# EAGLE schematic Plush6A (EAGLE 5.11)
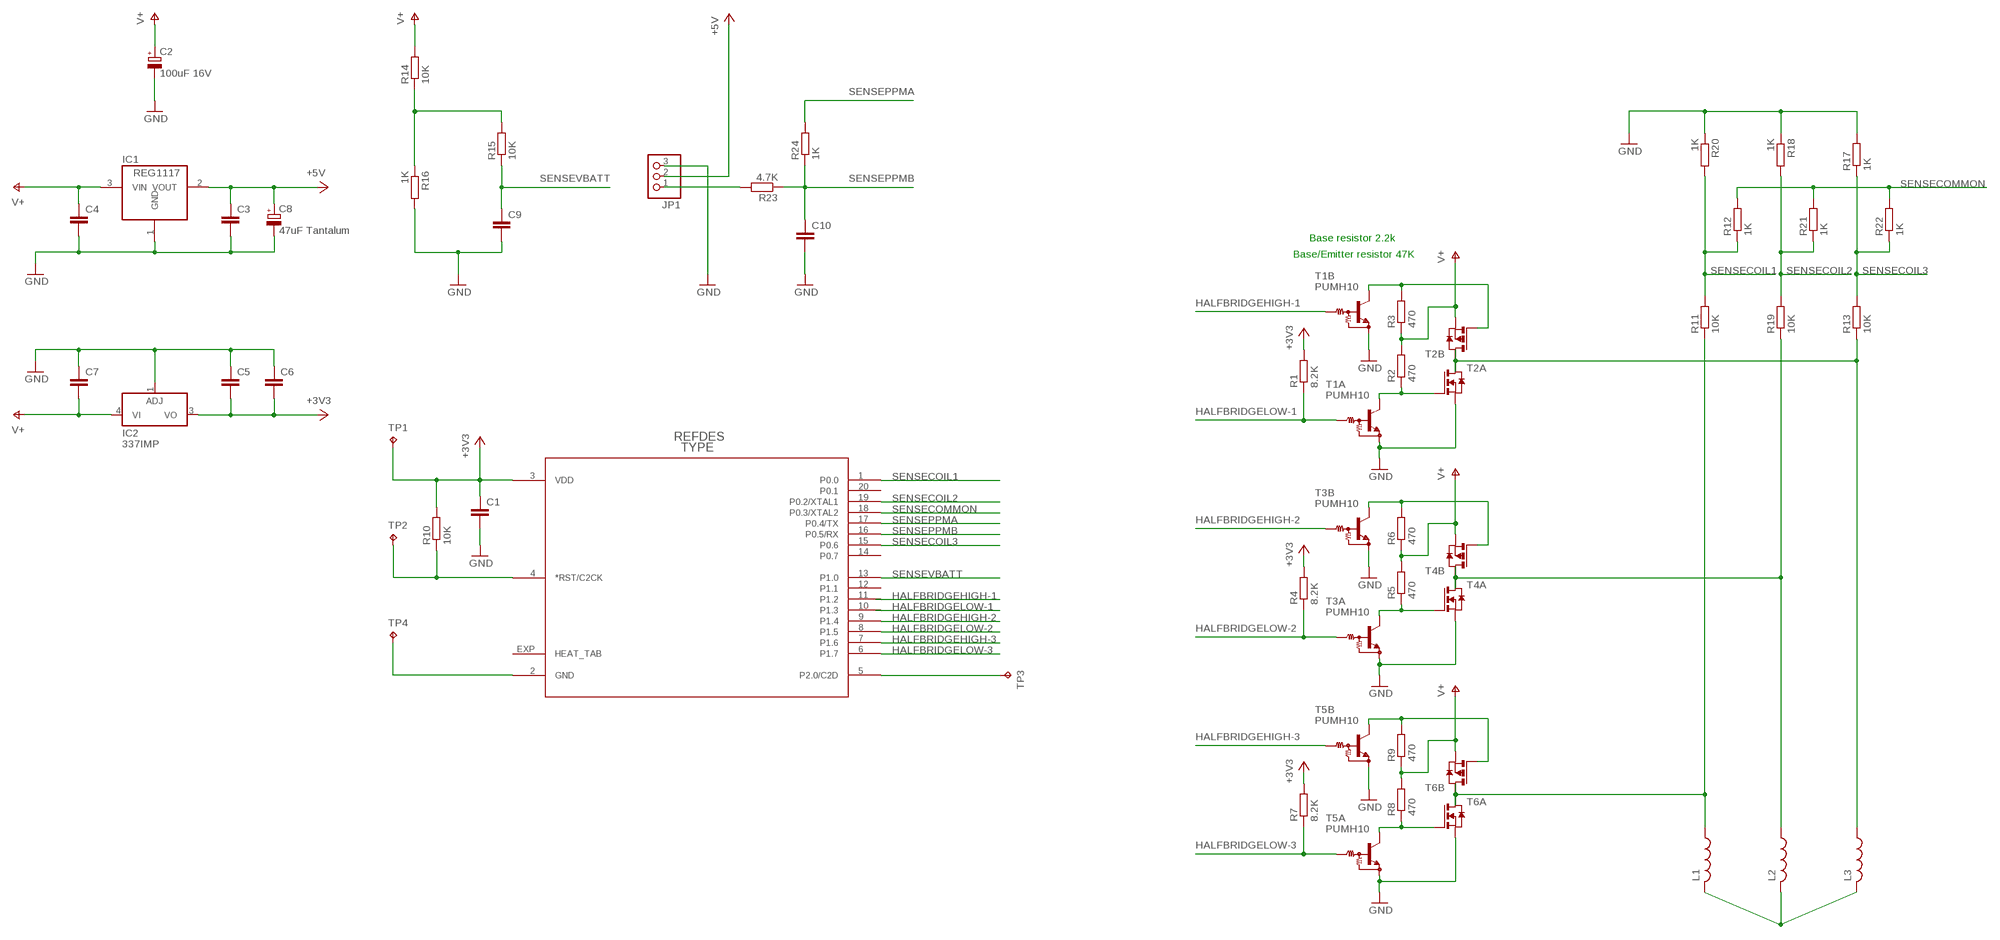
[diagram p0: schematic, sheet 1]

## Parts
C1  C-EUC0402  [C0402]
C2  100uF 16V  CPOL-EUE2.5-6  [E2,5-6]
C3  C-EUC0402  [C0402]
C4  C-EUC0402  [C0402]
C5  C-EUC0402  [C0402]
C6  C-EUC0402  [C0402]
C7  C-EUC0402  [C0402]
C8  47uF Tantalum  CPOL-EUE2.5-6  [E2,5-6]
C9  C-EUC0402  [C0402]
C10  C-EUC0402  [C0402]
IC1  REG1117  [SOT223]
IC2  337IMP  [SOT223]
JP1  PINHD-1X3  [1X03]
L1  L-US0204/5  [0204/5]
L2  L-US0204/5  [0204/5]
L3  L-US0204/5  [0204/5]
R1  8.2K  R-EU_M0805  [M0805]
R2  470  R-EU_M0805  [M0805]
R3  470  R-EU_M0805  [M0805]
R4  8.2K  R-EU_M0805  [M0805]
R5  470  R-EU_M0805  [M0805]
R6  470  R-EU_M0805  [M0805]
R7  8.2K  R-EU_M0805  [M0805]
R8  470  R-EU_M0805  [M0805]
R9  470  R-EU_M0805  [M0805]
R10  10K  R-EU_M0805  [M0805]
R11  10K  R-EU_M0805  [M0805]
R12  1K  R-EU_M0805  [M0805]
R13  10K  R-EU_M0805  [M0805]
R14  10K  R-EU_M0805  [M0805]
R15  10K  R-EU_M0805  [M0805]
R16  1K  R-EU_M0805  [M0805]
R17  1K  R-EU_M0805  [M0805]
R18  1K  R-EU_M0805  [M0805]
R19  10K  R-EU_M0805  [M0805]
R20  1K  R-EU_M0805  [M0805]
R21  1K  R-EU_M0805  [M0805]
R22  1K  R-EU_M0805  [M0805]
R23  4.7K  R-EU_M0805  [M0805]
R24  1K  R-EU_M0805  [M0805]
T1A  PUMH10  MUN2211T1-NPN_DRIVER-SC59-BEC  [SC59-BEC]
T1B  PUMH10  MUN2211T1-NPN_DRIVER-SC59-BEC  [SC59-BEC]
T2  PN_MOSFET-SO8  [SO8]
T3A  PUMH10  MUN2211T1-NPN_DRIVER-SC59-BEC  [SC59-BEC]
T3B  PUMH10  MUN2211T1-NPN_DRIVER-SC59-BEC  [SC59-BEC]
T4  PN_MOSFET-SO8  [SO8]
T5A  PUMH10  MUN2211T1-NPN_DRIVER-SC59-BEC  [SC59-BEC]
T5B  PUMH10  MUN2211T1-NPN_DRIVER-SC59-BEC  [SC59-BEC]
T6  PN_MOSFET-SO8  [SO8]
TP1  TPB1,27  [B1,27]
TP2  TPB1,27  [B1,27]
TP3  TPB1,27  [B1,27]
TP4  TPB1,27  [B1,27]
U$1  C8051F334  [MLP20]

## Nets
+3V3: C1.1 C5.2 C6.2 IC2.3(VO) R1.2 R4.2 R7.2 R10.2 TP1.TP U$1.3(VDD)
+5V: C3.1 C8.+ IC1.2(VOUT) JP1.2
GND: C1.2 C2.- C3.2 C4.2 C5.1 C6.1 C7.1 C8.- C9.2 C10.2 IC1.1(GND) IC2.1(ADJ) JP1.3 R16.2 R17.2 R18.1 R20.1 T1A.E T1B.E T2.1(A:S) T3A.E T3B.E T4.1(A:S) T5A.E T5B.E T6.1(A:S) TP4.TP U$1.2(GND)
HALFBRIDGEHIGH-1: T1B.B
HALFBRIDGEHIGH-2: T3B.B U$1.9(P1.4)
HALFBRIDGEHIGH-3: T5B.B U$1.7(P1.6)
HALFBRIDGELOW-1: R1.1 T1A.B
HALFBRIDGELOW-2: R4.1 T3A.B U$1.8(P1.5)
HALFBRIDGELOW-3: R7.1 T5A.B U$1.6(P1.7)
N$1: L3.1 R13.1 T2.5(B:D) T2.6(B:D2) T2.7(A:D) T2.8(A:D2)
N$3: R10.1 TP2.TP U$1.4(*RST/C2CK)
N$4: L1.2 L2.2 L3.2
N$5: TP3.TP U$1.5(P2.0/C2D)
N$7: R2.1 T1A.C T2.2(A:G)
N$8: L2.1 R19.1 T4.5(B:D) T4.6(B:D2) T4.7(A:D) T4.8(A:D2)
N$9: R3.2 T1B.C T2.4(B:G)
N$10: R5.1 T3A.C T4.2(A:G)
N$11: R6.2 T3B.C T4.4(B:G)
N$12: JP1.1 R23.2
N$13: L1.1 R11.1 T6.5(B:D) T6.6(B:D2) T6.7(A:D) T6.8(A:D2)
N$14: R8.1 T5A.C T6.2(A:G)
N$15: R9.2 T5B.C T6.4(B:G)
N$18: R14.1 R15.2 R16.1
SENSECOIL1: R11.2 R12.1 R20.2 U$1.1(P0.0)
SENSECOIL2: R18.2 R19.2 R21.1 U$1.19(P0.2/XTAL1)
SENSECOIL3: R13.2 R17.1 R22.1 U$1.15(P0.6)
SENSECOMMON: R12.2 R21.2 R22.2 U$1.18(P0.3/XTAL2)
SENSEPPMA: R24.2 U$1.17(P0.4/TX)
SENSEPPMB: C10.1 R23.1 R24.1 U$1.16(P0.5/RX)
SENSEVBATT: C9.1 R15.1 U$1.13(P1.0)
V+: C2.+ C4.1 C7.2 IC1.3(VIN) IC2.4(VI) R2.2 R3.1 R5.2 R6.1 R8.2 R9.1 R14.2 T2.3(B:S) T4.3(B:S) T6.3(B:S)
Unconnected: U$1.10(P1.3) U$1.11(P1.2) U$1.12(P1.1) U$1.14(P0.7) U$1.20(P0.1) U$1.EXP(HEAT_TAB)

## Notes on the sheet
- Base resistor 2.2k
- Base/Emitter resistor 47K

## Library data of the parts
C1 C3-C7 C9 C10 = resistor:C-EU: CAPACITOR, European symbol
C2 C8 = rcl:CPOL-EU: POLARIZED CAPACITOR, European symbol
IC1 = burr-brown:REG1117: 800mA and 1A Low Dropout (LDO) Positive Regulator 1.8V, 2.5V, 2.85V, 3.3V, 5V, and Adj; MPN: REG1117; OC_FARNELL: 1097566; OC_NEWARK: 14P6981
IC2 = linear:*337: Negative VOLTAGE REGULATOR
JP1 = pinhead:PINHD-1X3: PIN HEADER
L1-L3 = rcl:L-US: INDUCTOR, American symbol
R1-R24 = resistor:R-EU_: RESISTOR, European symbol
T1A T1B T3A T3B T5A T5B = transistor:*-NPN_DRIVER-: NPN Bias Resistor Transistor
T2 T4 T6 = zetex:PN_MOSFET-: DUAL N AND P-CHANNEL ENHANCEMENT MODE MOSFET source ZXMD63C02.pdf from http://www.zetex.com/; OC_FARNELL: unknown; OC_NEWARK: unknown
TP1-TP4 = testpad:TP: Test pad
U$1 = silabs:C8051F334